# Altium schematic sheet power-v1v2.SchDoc: Power 1.2V
size Letter; CheckedBy: J. Brinton; CompanyName: Signal Laboratories, Inc.; DrawnBy: J. Brinton; Engineer: J. Brinton; Address1: 3479 Edison Way; Address2: Menlo Park CA 94025; Address3: +1 (877) 778-8435; Address4: siglabs.com; Revision: 3; SheetNumber: 37; SheetTotal: 45
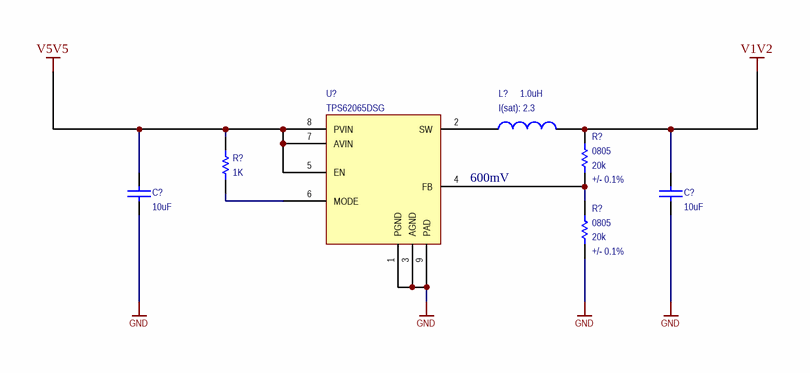
[diagram p0: power-v1v2.SchDoc]

## Parts
(Parts that share a designator on the sheet are numbered #1, #2 ... from top to bottom, then left to right.)
C?#1  value 10uF  [0603]  (hidden comment: CL10A106MA8NRNC)
C?#2  value 10uF  [0603]  (hidden comment: CL10A106MA8NRNC)
L?  value 1.0uH  I(sat): 2.3  [ASPI-0310FS]  (hidden comment: ASPI-0310FS-1R0N-T2)
R?#1  value 20k  Tolerance: +/- 0.1%  Package: 0805  [RESC2012X70N]  (hidden comment: RG2012P-203-B-T5)
R?#2  value 1K  [RESC1005X40N]  (hidden comment: RC0402FR-071KL)
R?#3  value 20k  Tolerance: +/- 0.1%  Package: 0805  [RESC2012X70N]  (hidden comment: RG2012P-203-B-T5)
U?  TPS62065DSG  [DSG]

## Nets
GND: C?#1.1 C?#2.1 R?#3.1 U?.1(PGND) U?.3(AGND) U?.9(PAD)
V1V2: C?#2.2 L?.2 R?#1.2
V5V5: C?#1.2 R?#2.2 U?.5(EN) U?.7(AVIN) U?.8(PVIN)
NetL?_1: L?.1 U?.2(SW)
NetR?#1_1: R?#1.1 R?#3.2 U?.4(FB)
NetR?#2_1: R?#2.1 U?.6(MODE)

## Notes on the sheet
- 600mV
- Title
- Engineer
- Revision
- Drawn By
- Checked By
- Date
- Sheet
- of

## Library data of the parts
C?#1 C?#2 = CAP 0603: Ceramic Capacitor 10uF ±20% 25V X5R 0603; Manufacturer: Samsung; Tr: -55:85; Manufacturer P/N: CL10A106MA8NRNC; Voltage: 25V; Package: 0603; Tolerance: ±20%
L? = COIL: Wirewound Ferite Power Inductor 1.0uH ±20% 2.3A SMD; Manufacturer: Abracon; Tolerance: ±30%; Tr: -25:120; Manufacturer P/N: ASPI-0310FS-1R0N-T2; Package: 3x3mm
R?#1 R?#3 = RES: Thin Film Resistor 20k +/-0.1% SMD 0805; Manufacturer: Susumu; Tr: -55:155; Tcr: *; Manufacturer P/N: RG2012P-203-B-T5; Alternatives: *; Voltage: *; Power: *
R?#2 = RES 0402: Thick Film Resistor 1k ±1% 0402; Manufacturer: Yageo; Tr: -55:155; Manufacturer P/N: RC0402FR-071KL; Package: 0402; Tolerance: ±1%
U? = TPS62065: Tiny 6V input 2A Synchronous Buck w/ Internal Switch and MODE; Manufacturer: Texas Instruments; Manufacturer P/N: TPS62065DSG